# EAGLE design tiny2313 (EAGLE 6.4)
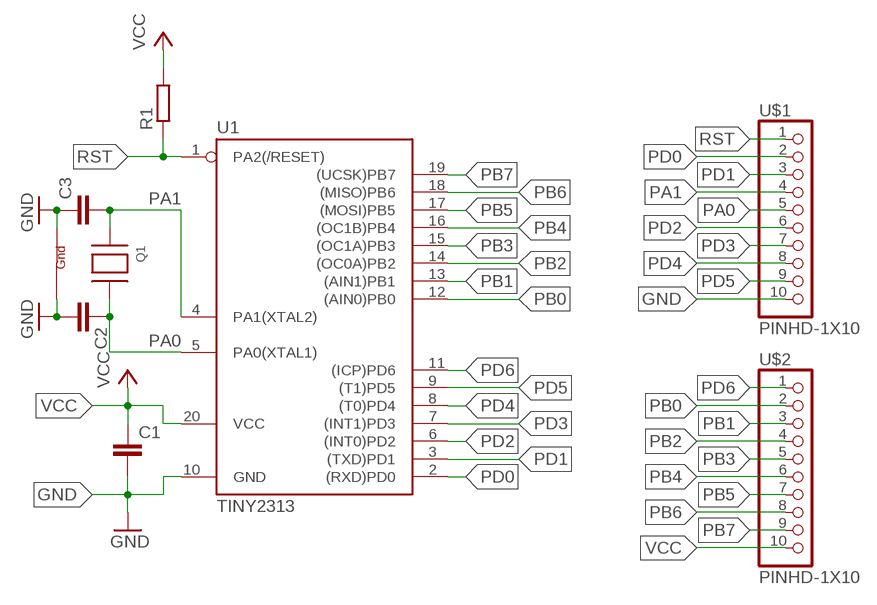
[diagram p0: schematic, sheet 1]

## Parts
C1  C-EUC0805  [C0805]
C2  C-EUC0805  [C0805]
C3  C-EUC0805  [C0805]
Q1  XTAL-4-3225  [NX3225]
R1  R-EU_R0805  [R0805]
U1  TINY2313  TINY2313-*S*  [SO20L$]
U$1  PINHD-1X10  [1X10-BIG]
U$2  PINHD-1X10  [1X10-BIG]

## Nets
GND: C1.2 C2.2 C3.1 Q1.2(G2) Q1.4(G1) U1.10(GND) U$1.10
PA0: C2.1 Q1.3(X2) U1.5(PA0(XTAL1)) U$1.5
PA1: C3.2 Q1.1(X1) U1.4(PA1(XTAL2)) U$1.4
PB0: U1.12((AIN0)PB0) U$2.2
PB1: U1.13((AIN1)PB1) U$2.3
PB2: U1.14((OC0A)PB2) U$2.4
PB3: U1.15((OC1A)PB3) U$2.5
PB4: U1.16((OC1B)PB4) U$2.6
PB5: U1.17((MOSI)PB5) U$2.7
PB6: U1.18((MISO)PB6) U$2.8
PB7: U1.19((UCSK)PB7) U$2.9
PD0: U1.2((RXD)PD0) U$1.2
PD1: U1.3((TXD)PD1) U$1.3
PD2: U1.6((INT0)PD2) U$1.6
PD3: U1.7((INT1)PD3) U$1.7
PD4: U1.8((T0)PD4) U$1.8
PD5: U1.9((T1)PD5) U$1.9
PD6: U1.11((ICP)PD6) U$2.1
RST: R1.1 U1.1(PA2(/RESET)) U$1.1
VCC: C1.1 R1.2 U1.20(VCC) U$2.10

## Library data of the parts
C1-C3 = rcl:C-EU: CAPACITOR, European symbol
Q1 = adafruit:XTAL-4: Classic 4-pin 3.2 x 2.5mm crystal
R1 = Bona:R-EU_: RESISTOR, European symbol
U1 = avr-6:TINY2313*: Atmel Tiny2313 2K Flash, 128 bytes EEPROM, 128 bytes RAM
U$1 U$2 = adafruit:PINHD-1X10: Pin header 1x10 0.1" spacing With round pins

## Board
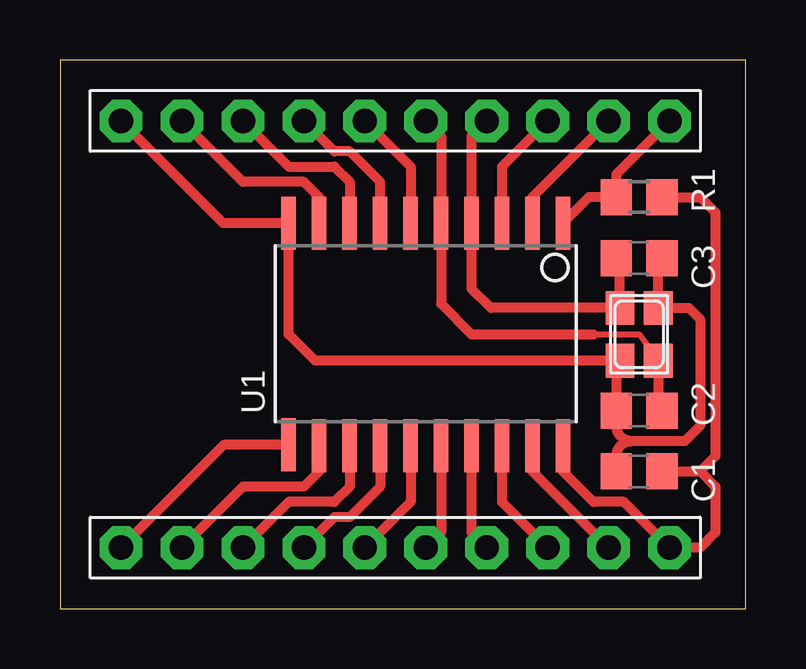
[diagram p1: board, top side]

Size 28.57 x 22.86 mm. Coordinates in mm from the lower left corner, seen from the top.
Outline: 0,0 28.57,0 28.57,22.86 0,22.86 0,0
Copper layers (1*16): Top 0.035mm / dielectric 1.5mm / Bottom 0.035mm
Design rules "default": minimum track width 10mil, minimum drill 24mil, track to track 8mil, track to pad 8mil, pad to pad 8mil, via to via 8mil, smd to smd 8mil, copper to edge 40mil, drill to drill 8mil, minimum pad ring 10mil, minimum via ring 8mil, stop-mask expansion 4mil, vias tented up to drill 0mil, thermal gap 10mil

### Footprints (pad centres in the part's own frame; a part is rotated, then mirrored left to right if it is on the bottom)
C0805 = smd 1.3 x 1.5: 1 -0.95,0; 2 0.95,0
NX3225 = smd 1.4 x 1.2: 1 -1.1,-0.8; 2 1.1,-0.8; 3 1.1,0.8; 4 -1.1,0.8
R0805 = smd 1.3 x 1.5: 1 -0.95,0; 2 0.95,0
SO20L$ = smd 0.61 x 2.21: 1 -5.715,-4.636; 2 -4.445,-4.636; 3 -3.175,-4.636; 4 -1.905,-4.636; 5 -0.635,-4.636; 6 0.635,-4.636; 7 1.905,-4.636; 8 3.175,-4.636; 9 4.445,-4.636; 10 5.715,-4.636; 11 5.715,4.61; 12 4.445,4.636; 13 3.175,4.636; 14 1.905,4.636; 15 0.635,4.636; 16 -0.635,4.636; 17 -1.905,4.636; 18 -3.175,4.636; 19 -4.445,4.636; 20 -5.715,4.636
1X10-BIG = drill 1.016 pad 1.778 octagon: 1 -11.43,0; 2 -8.89,0; 3 -6.35,0; 4 -3.81,0; 5 -1.27,0; 6 1.27,0; 7 3.81,0; 8 6.35,0; 9 8.89,0; 10 11.43,0

### Placement (x,y rotation side)
C1  24.13,5.71 180 top
C2  24.13,8.26 180 top
C3  24.13,14.61 180 top
Q1  24.13,11.43 270 top
R1  24.13,17.14 0 top
U1  15.24,11.43 180 top
U$1  13.97,20.32 180 top
U$2  13.97,2.54 0 top

### Tracks (layer width: path | path; a pad name or v marks a point on that pad's centre or on a via)
GND
  Top 0.406: U$1.10 6.79,16.07 U1.10 9.53,11.43 10.62,10.33 Q1.2 23.18,10.33 C2.2 23.18,7.62 arc90 23.82,6.99 | C3.1 24.93,14.46 Q1.4 26.2,12.53 26.67,12.06 26.67,7.62 26.04,6.99 23.82,6.99 | C1.2 23.18,6.35 arc-90 23.82,6.99
PA0
  Top 0.254: 22.23,11.43 24.13,11.43 Q1.3
  Top 0.406: C2.1 24.93,8.4 Q1.3 24.93,10.63 | U$1.5 15.88,19.68 U1.5 15.88,12.7 17.14,11.43 22.23,11.43
PA1
  Top 0.406: C3.2 23.33,14.46 Q1.1 17.95,12.53 17.14,13.34 U1.4 17.14,19.68 U$1.4
PB0
  Top 0.406: U1.12 10.79,5.71 10.16,5.08 7.62,5.08 U$2.2
PB1
  Top 0.406: U1.13 12.06,5.08 11.43,4.45 9.53,4.45 U$2.3
PB2
  Top 0.406: U$2.4 11.43,3.81 12.06,3.81 13.34,5.08 U1.14
PB3
  Top 0.406: U1.15 14.61,4.45 U$2.5
PB4
  Top 0.406: U$2.6 15.88,3.17 U1.16
PB5
  Top 0.406: U$2.7 17.14,3.17 U1.17
PB6
  Top 0.406: U$2.8 18.41,4.45 U1.18
PB7
  Top 0.406: U1.19 19.68,5.71 U$2.9
PD0
  Top 0.406: U$1.2 19.68,17.14 U1.2
PD1
  Top 0.406: U$1.3 18.41,18.41 U1.3
PD2
  Top 0.406: U$1.6 14.61,18.41 U1.6
PD3
  Top 0.406: U$1.7 11.43,19.05 12.06,19.05 13.34,17.78 U1.7
PD4
  Top 0.406: U$1.8 9.53,18.41 11.43,18.41 12.06,17.78 U1.8
PD5
  Top 0.406: U1.9 10.79,17.14 10.16,17.78 7.62,17.78 U$1.9
PD6
  Top 0.406: U1.11 6.82,6.82 U$2.1
RST
  Top 0.406: 20.95,16.51 U1.1 22.04,17.14 R1.1 23.18,18.1 U$1.1
VCC
  Top 0.406: C1.1 25.08,6.03 | U1.20 20.95,5.71 22.23,4.45 23.5,4.45 U$2.10 26.67,2.54 27.3,3.17 27.3,5.08 26.67,5.71 | 25.4,6.03 C1.1 | 24.77,6.04 C1.1 | 26.67,5.71 27.3,6.35 27.3,16.51 26.67,17.14 R1.2 | C1.1 26.67,5.71